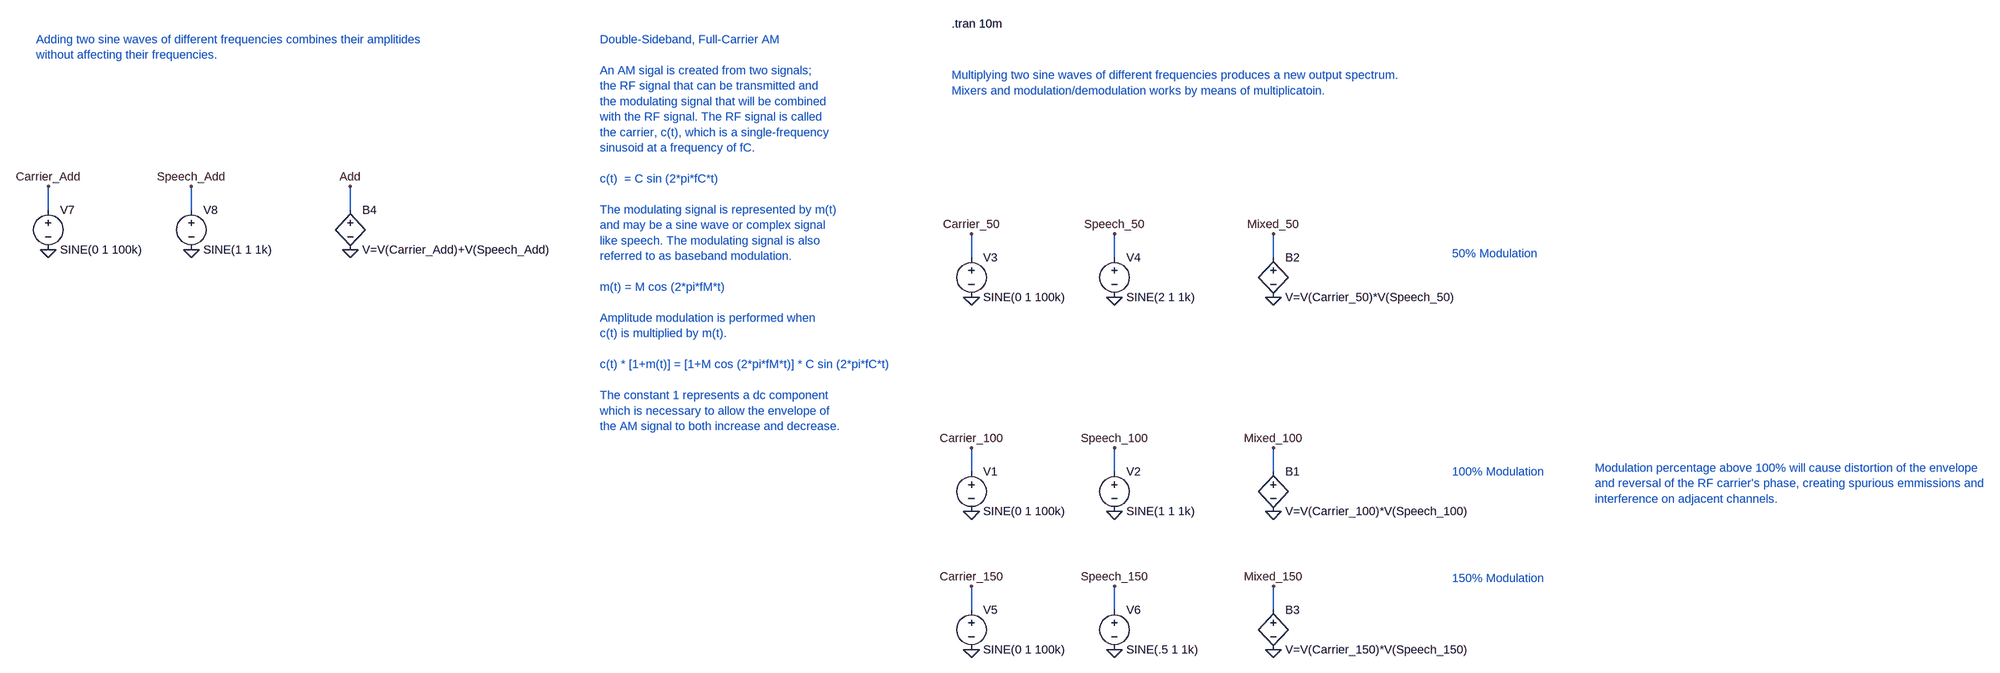
[diagram p0: schematic AM_Modulation.asc]
AM_Modulation.asc, the LTspice schematic file:
Version 4
SHEET 1 2036 680
WIRE -2016 -384 -2016 -432
WIRE -1728 -384 -1728 -432
WIRE -1408 -384 -1408 -432
WIRE -144 -288 -144 -336
WIRE 144 -288 144 -336
WIRE 464 -288 464 -336
WIRE -144 144 -144 96
WIRE 144 144 144 96
WIRE 464 144 464 96
WIRE -144 576 -144 528
WIRE 144 576 144 528
WIRE 464 576 464 528
FLAG -144 224 0
FLAG 144 224 0
FLAG 464 224 0
FLAG -144 96 Carrier_100
FLAG 144 96 Speech_100
FLAG 464 96 Mixed_100
FLAG -144 -208 0
FLAG 144 -208 0
FLAG 464 -208 0
FLAG -144 -336 Carrier_50
FLAG 144 -336 Speech_50
FLAG 464 -336 Mixed_50
FLAG -144 656 0
FLAG 144 656 0
FLAG 464 656 0
FLAG -144 528 Carrier_150
FLAG 144 528 Speech_150
FLAG 464 528 Mixed_150
FLAG -2016 -304 0
FLAG -1728 -304 0
FLAG -1408 -304 0
FLAG -2016 -432 Carrier_Add
FLAG -1728 -432 Speech_Add
FLAG -1408 -432 Add
SYMBOL voltage -144 128 R0
WINDOW 123 0 0 Left 0
WINDOW 39 0 0 Left 0
SYMATTR InstName V1
SYMATTR Value SINE(0 1 100k)
SYMBOL voltage 144 128 R0
WINDOW 123 0 0 Left 0
WINDOW 39 0 0 Left 0
SYMATTR InstName V2
SYMATTR Value SINE(1 1 1k)
SYMBOL bv 464 128 R0
SYMATTR InstName B1
SYMATTR Value V=V(Carrier_100)*V(Speech_100)
SYMBOL voltage -144 -304 R0
WINDOW 123 0 0 Left 0
WINDOW 39 0 0 Left 0
SYMATTR InstName V3
SYMATTR Value SINE(0 1 100k)
SYMBOL voltage 144 -304 R0
WINDOW 123 0 0 Left 0
WINDOW 39 0 0 Left 0
SYMATTR InstName V4
SYMATTR Value SINE(2 1 1k)
SYMBOL bv 464 -304 R0
SYMATTR InstName B2
SYMATTR Value V=V(Carrier_50)*V(Speech_50)
SYMBOL voltage -144 560 R0
WINDOW 123 0 0 Left 0
WINDOW 39 0 0 Left 0
SYMATTR InstName V5
SYMATTR Value SINE(0 1 100k)
SYMBOL voltage 144 560 R0
WINDOW 123 0 0 Left 0
WINDOW 39 0 0 Left 0
SYMATTR InstName V6
SYMATTR Value SINE(.5 1 1k)
SYMBOL bv 464 560 R0
SYMATTR InstName B3
SYMATTR Value V=V(Carrier_150)*V(Speech_150)
SYMBOL voltage -2016 -400 R0
WINDOW 123 0 0 Left 0
WINDOW 39 0 0 Left 0
SYMATTR InstName V7
SYMATTR Value SINE(0 1 100k)
SYMBOL voltage -1728 -400 R0
WINDOW 123 0 0 Left 0
WINDOW 39 0 0 Left 0
SYMATTR InstName V8
SYMATTR Value SINE(1 1 1k)
SYMBOL bv -1408 -400 R0
SYMATTR InstName B4
SYMATTR Value V=V(Carrier_Add)+V(Speech_Add)
TEXT -184 -760 Left 2 !.tran 10m
TEXT 824 144 Left 2 ;100% Modulation
TEXT 824 -296 Left 2 ;50% Modulation
TEXT 824 512 Left 2 ;150% Modulation
TEXT 1176 136 Left 2 ;Modulation percentage above 100% will cause distortion of the envelope \nand reversal of the RF carrier's phase, creating spurious emmissions and\ninterference on adjacent channels.
TEXT -2040 -728 Left 2 ;Adding two sine waves of different frequencies combines their amplitides\nwithout affecting their frequencies.
TEXT -184 -656 Left 2 ;Multiplying two sine waves of different frequencies produces a new output spectrum.\nMixers and modulation/demodulation works by means of multiplicatoin.
TEXT -904 -728 Left 2 ;Double-Sideband, Full-Carrier AM\n \nAn AM sigal is created from two signals;\nthe RF signal that can be transmitted and\nthe modulating signal that will be combined\nwith the RF signal. The RF signal is called \nthe carrier, c(t), which is a single-frequency\nsinusoid at a frequency of fC.\n \nc(t)  = C sin (2*pi*fC*t)\n \nThe modulating signal is represented by m(t)\nand may be a sine wave or complex signal\nlike speech. The modulating signal is also\nreferred to as baseband modulation.\n \nm(t) = M cos (2*pi*fM*t)\n \nAmplitude modulation is performed when\nc(t) is multiplied by m(t).\n \nc(t) * [1+m(t)] = [1+M cos (2*pi*fM*t)] * C sin (2*pi*fC*t)\n \nThe constant 1 represents a dc component\nwhich is necessary to allow the envelope of\nthe AM signal to both increase and decrease.

The netlist it stands for:
* AM_Modulation.asc
V1 Carrier_100 0 SINE(0 1 100k)
V2 Speech_100 0 SINE(1 1 1k)
B1 Mixed_100 0 V=V(Carrier_100)*V(Speech_100)
V3 Carrier_50 0 SINE(0 1 100k)
V4 Speech_50 0 SINE(2 1 1k)
B2 Mixed_50 0 V=V(Carrier_50)*V(Speech_50)
V5 Carrier_150 0 SINE(0 1 100k)
V6 Speech_150 0 SINE(.5 1 1k)
B3 Mixed_150 0 V=V(Carrier_150)*V(Speech_150)
V7 Carrier_Add 0 SINE(0 1 100k)
V8 Speech_Add 0 SINE(1 1 1k)
B4 Add 0 V=V(Carrier_Add)+V(Speech_Add)
.tran 10m
* 100% Modulation
* 50% Modulation
* 150% Modulation
* Modulation percentage above 100% will cause distortion of the envelope
* and reversal of the RF carrier's phase, creating spurious emmissions and
* interference on adjacent channels.
* Adding two sine waves of different frequencies combines their amplitides
* without affecting their frequencies.
* Multiplying two sine waves of different frequencies produces a new output spectrum.
* Mixers and modulation/demodulation works by means of multiplicatoin.
* Double-Sideband, Full-Carrier AM
* An AM sigal is created from two signals;
* the RF signal that can be transmitted and
* the modulating signal that will be combined
* with the RF signal. The RF signal is called
* the carrier, c(t), which is a single-frequency
* sinusoid at a frequency of fC.
* c(t)  = C sin (2*pi*fC*t)
* The modulating signal is represented by m(t)
* and may be a sine wave or complex signal
* like speech. The modulating signal is also
* referred to as baseband modulation.
* m(t) = M cos (2*pi*fM*t)
* Amplitude modulation is performed when
* c(t) is multiplied by m(t).
* c(t) * [1+m(t)] = [1+M cos (2*pi*fM*t)] * C sin (2*pi*fC*t)
* The constant 1 represents a dc component
* which is necessary to allow the envelope of
* the AM signal to both increase and decrease.
.backanno
.end